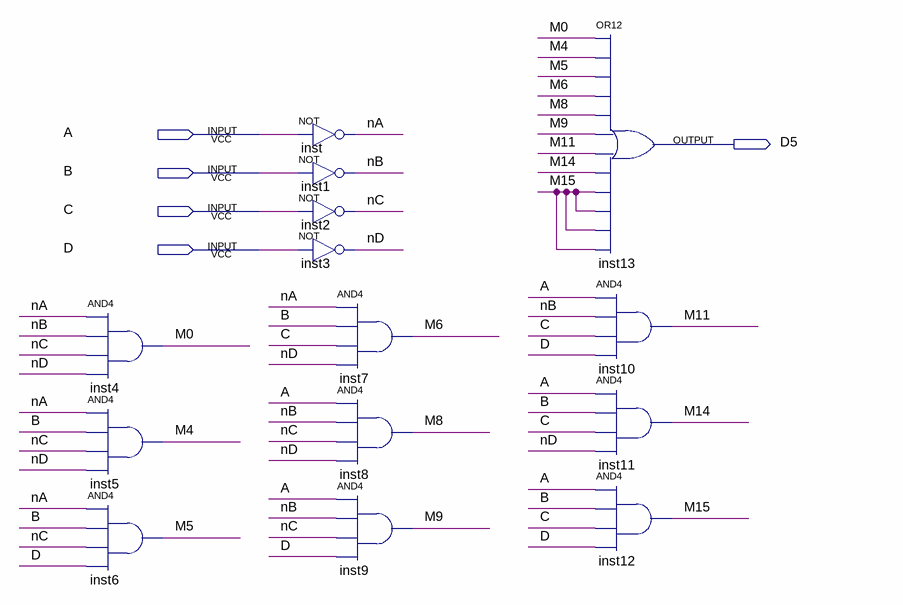
[diagram p0: schematic sheet]
// Quartus schematic display_d5.bdf as structural Verilog: 14 symbols, 5 pins
module display_d5 (
  input  A,
  input  B,
  input  C,
  input  D,
  output D5
);

  wire M0, M4, M5, M6, M8, M9, M11, M14, M15, nA, nB, nC, nD;

  and inst4 (M0, nA, nB, nC, nD);
  and inst5 (M4, nA, B, nC, nD);
  and inst6 (M5, nA, B, nC, D);
  not inst (nA, A);
  not inst1 (nB, B);
  not inst2 (nC, C);
  not inst3 (nD, D);
  and inst7 (M6, nA, B, C, nD);
  and inst8 (M8, A, nB, nC, nD);
  and inst9 (M9, A, nB, nC, D);
  or inst13 (D5, M0, M4, M5, M6, M8, M9, M11, M14, M15, M15, M15, M15);
  and inst10 (M11, A, nB, C, D);
  and inst11 (M14, A, B, C, nD);
  and inst12 (M15, A, B, C, D);
endmodule
